# EAGLE design v01 (EAGLE 6.6.0)
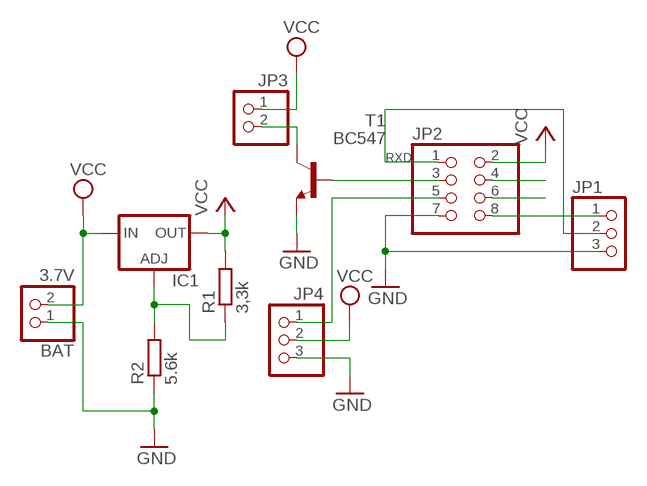
[diagram p0: schematic, sheet 1]

## Parts
BAT  3.7V  PINHD-1X2/90  [1X02/90]
IC1  LM317TL  [317TL]
JP1  PINHD-1X3/90  [1X03/90]
JP2  PINHD-2X4  [2X04]
JP3  PINHD-1X2  [1X02]
JP4  PINHD-1X3  [1X03]
R1  3,3k  R-EU_0207/10  [0207/10]
R2  5.6k  R-EU_0207/10  [0207/10]
T1  BC547  [TO92]

## Nets
BAT: BAT.2 IC1.3(IN) JP3.1 JP4.2 ; supply symbol labelled VCC
CHPD: JP2.6
GND: BAT.1 JP1.3 JP2.7 JP4.3 R2.1 T1.1(E)
GPIO0: JP2.3 T1.2(B)
GPIO2: JP2.5 JP4.1
N$1: IC1.1(ADJ) R1.1 R2.2
N$2: JP3.2 T1.3(C)
N$3: JP1.1 JP2.8
RST: JP2.4
RXD: JP1.2 JP2.1
VCC: IC1.2(OUT) JP2.2 R1.2

## Library data of the parts
BAT JP3 = pinhead:PINHD-1X2: PIN HEADER
IC1 = v-reg:LM317TL: VOLTAGE REGULATOR
JP1 JP4 = pinhead:PINHD-1X3: PIN HEADER
JP2 = pinhead:PINHD-2X4: PIN HEADER
R1 R2 = rcl:R-EU_: RESISTOR, European symbol
T1 = transistor:BC547: NPN TRANSISTOR

## Board
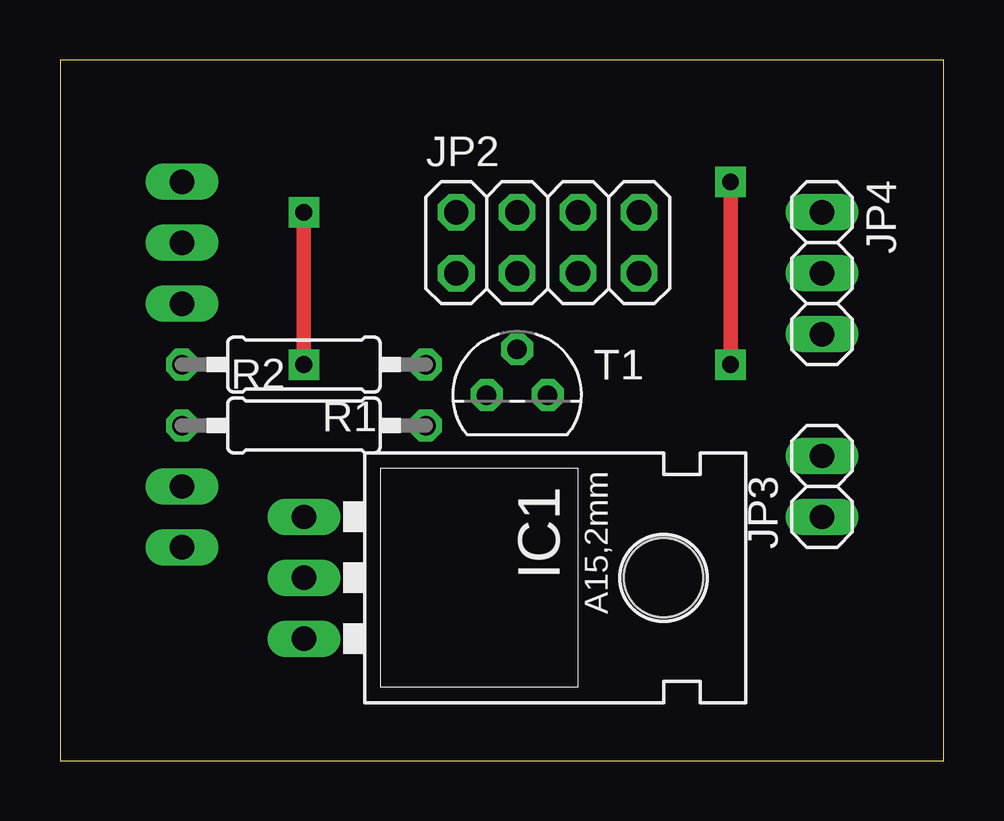
[diagram p1: board, top side]
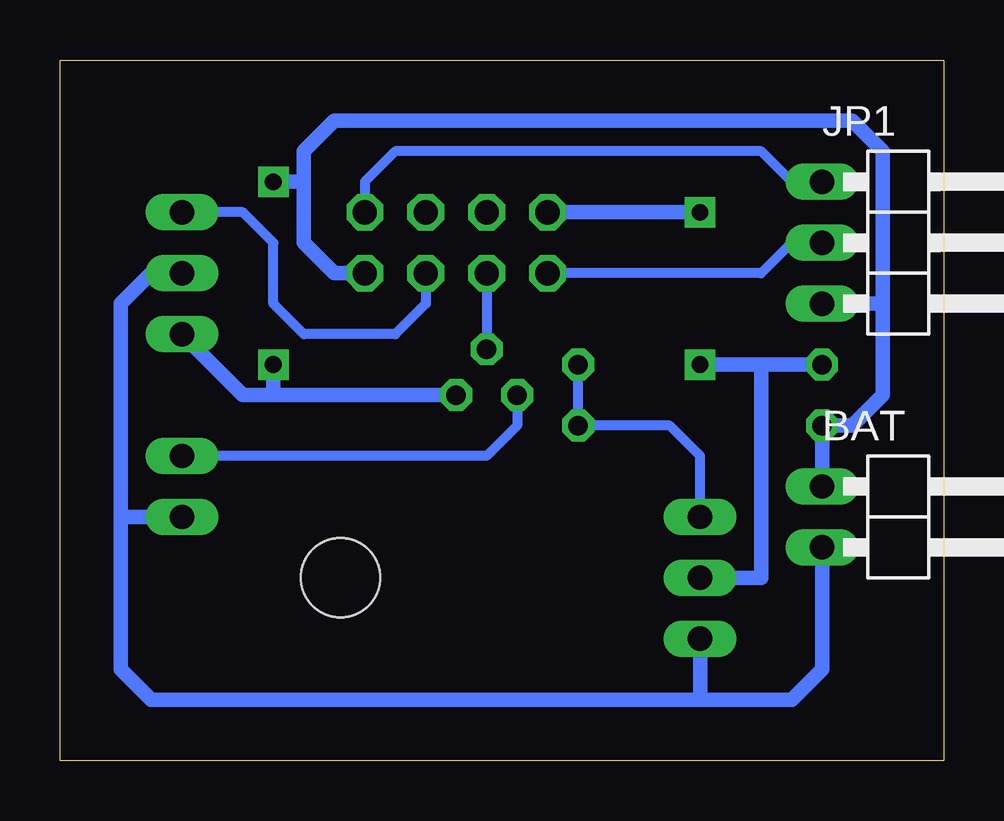
[diagram p2: board, bottom side, seen from below]

Size 36.83 x 29.21 mm. Coordinates in mm from the lower left corner, seen from the top.
Outline: 0,0 36.83,0 36.83,29.21 0,29.21 0,0
Copper layers (1*16): Top 0.035mm / dielectric 1.5mm / Bottom 0.035mm
Design rules "default": minimum track width 10mil, minimum drill 24mil, track to track 8mil, track to pad 8mil, pad to pad 8mil, via to via 8mil, smd to smd 8mil, copper to edge 40mil, drill to drill 8mil, minimum pad ring 10mil, minimum via ring 8mil, stop-mask expansion 4mil, vias tented up to drill 0mil, thermal gap 10mil

### Footprints (pad centres in the part's own frame; a part is rotated, then mirrored left to right if it is on the bottom)
1X02/90 = drill 1.016 long: 1 -1.27,-3.81; 2 1.27,-3.81
317TL = drill 1.016 long: 1 -2.54,-3.81; 2 0,-3.81; 3 2.54,-3.81 | hole 3.302: 0,11.176
1X03/90 = drill 1.016 long: 1 -2.54,-3.81; 2 0,-3.81; 3 2.54,-3.81
2X04 = drill 1.016 octagon: 1 -3.81,-1.27; 2 -3.81,1.27; 3 -1.27,-1.27; 4 -1.27,1.27; 5 1.27,-1.27; 6 1.27,1.27; 7 3.81,-1.27; 8 3.81,1.27
1X02 = drill 1.016 long: 1 -1.27,0; 2 1.27,0
1X03 = drill 1.016 long: 1 -2.54,0; 2 0,0; 3 2.54,0
0207/10 = drill 0.813 octagon: 1 -5.08,0; 2 5.08,0
TO92 = drill 0.813 octagon: 1 1.27,0; 2 0,1.905; 3 -1.27,0

### Placement (x,y rotation side)
BAT  1.27,10.16 270 bottom
IC1  13.97,7.62 270 top
JP1  1.27,21.59 270 bottom
JP2  20.32,21.59 0 top
JP3  31.75,11.43 90 top
JP4  31.75,20.32 270 top
R1  10.16,16.51 180 top
R2  10.16,13.97 0 top
T1  19.05,15.24 0 top

### Tracks (layer width: path | path; a pad name or v marks a point on that pad's centre or on a via)
BAT
  Bottom 0.61: BAT.2 5.08,3.81 6.35,2.54 10.16,2.54 | JP3.1 34.29,10.16 | 34.29,10.16 34.29,19.05 33.02,20.32 JP4.2 | IC1.3 10.16,2.54 | 10.16,2.54 33.02,2.54 34.29,3.81 34.29,10.16
GND  (via drill 0.7 pad 1.27)
  Top 0.61: v27.94,24.13 v27.94,16.51
  Bottom 0.61: BAT.1 R2.1 3.81,13.97 2.54,15.24 2.54,19.05 | 27.94,15.24 29.21,15.24 JP4.3 | JP2.7 25.4,20.32 26.67,21.59 26.67,24.13 | 26.67,24.13 v27.94,24.13 | JP1.3 2.54,19.05 | 2.54,19.05 2.54,25.4 3.81,26.67 25.4,26.67 26.67,25.4 26.67,24.13 | T1.1 27.94,15.24 | 27.94,15.24 v27.94,16.51
GPIO0
  Bottom 0.406: JP2.3 T1.2
GPIO2
  Bottom 0.406: JP2.5 21.59,19.05 22.86,17.78 26.67,17.78 27.94,19.05 27.94,21.59 29.21,22.86 JP4.1
N$1
  Bottom 0.406: IC1.1 10.16,12.7 11.43,13.97 R2.2 R1.1
N$2
  Bottom 0.406: T1.3 17.78,13.97 19.05,12.7 JP3.2
N$3
  Bottom 0.406: JP2.8 24.13,24.13 22.86,25.4 7.62,25.4 6.35,24.13 JP1.1
RXD
  Bottom 0.406: JP1.2 6.35,21.59 7.62,20.32 JP2.1
VCC  (via drill 0.7 pad 1.27)
  Top 0.61: v10.16,22.86 v10.16,16.51
  Bottom 0.61: IC1.2 7.62,7.62 7.62,16.51 | 7.62,16.51 v10.16,16.51 | 7.62,16.51 R1.2 | JP2.2 v10.16,22.86